# EAGLE design GBM-14to6 (EAGLE 5.12)
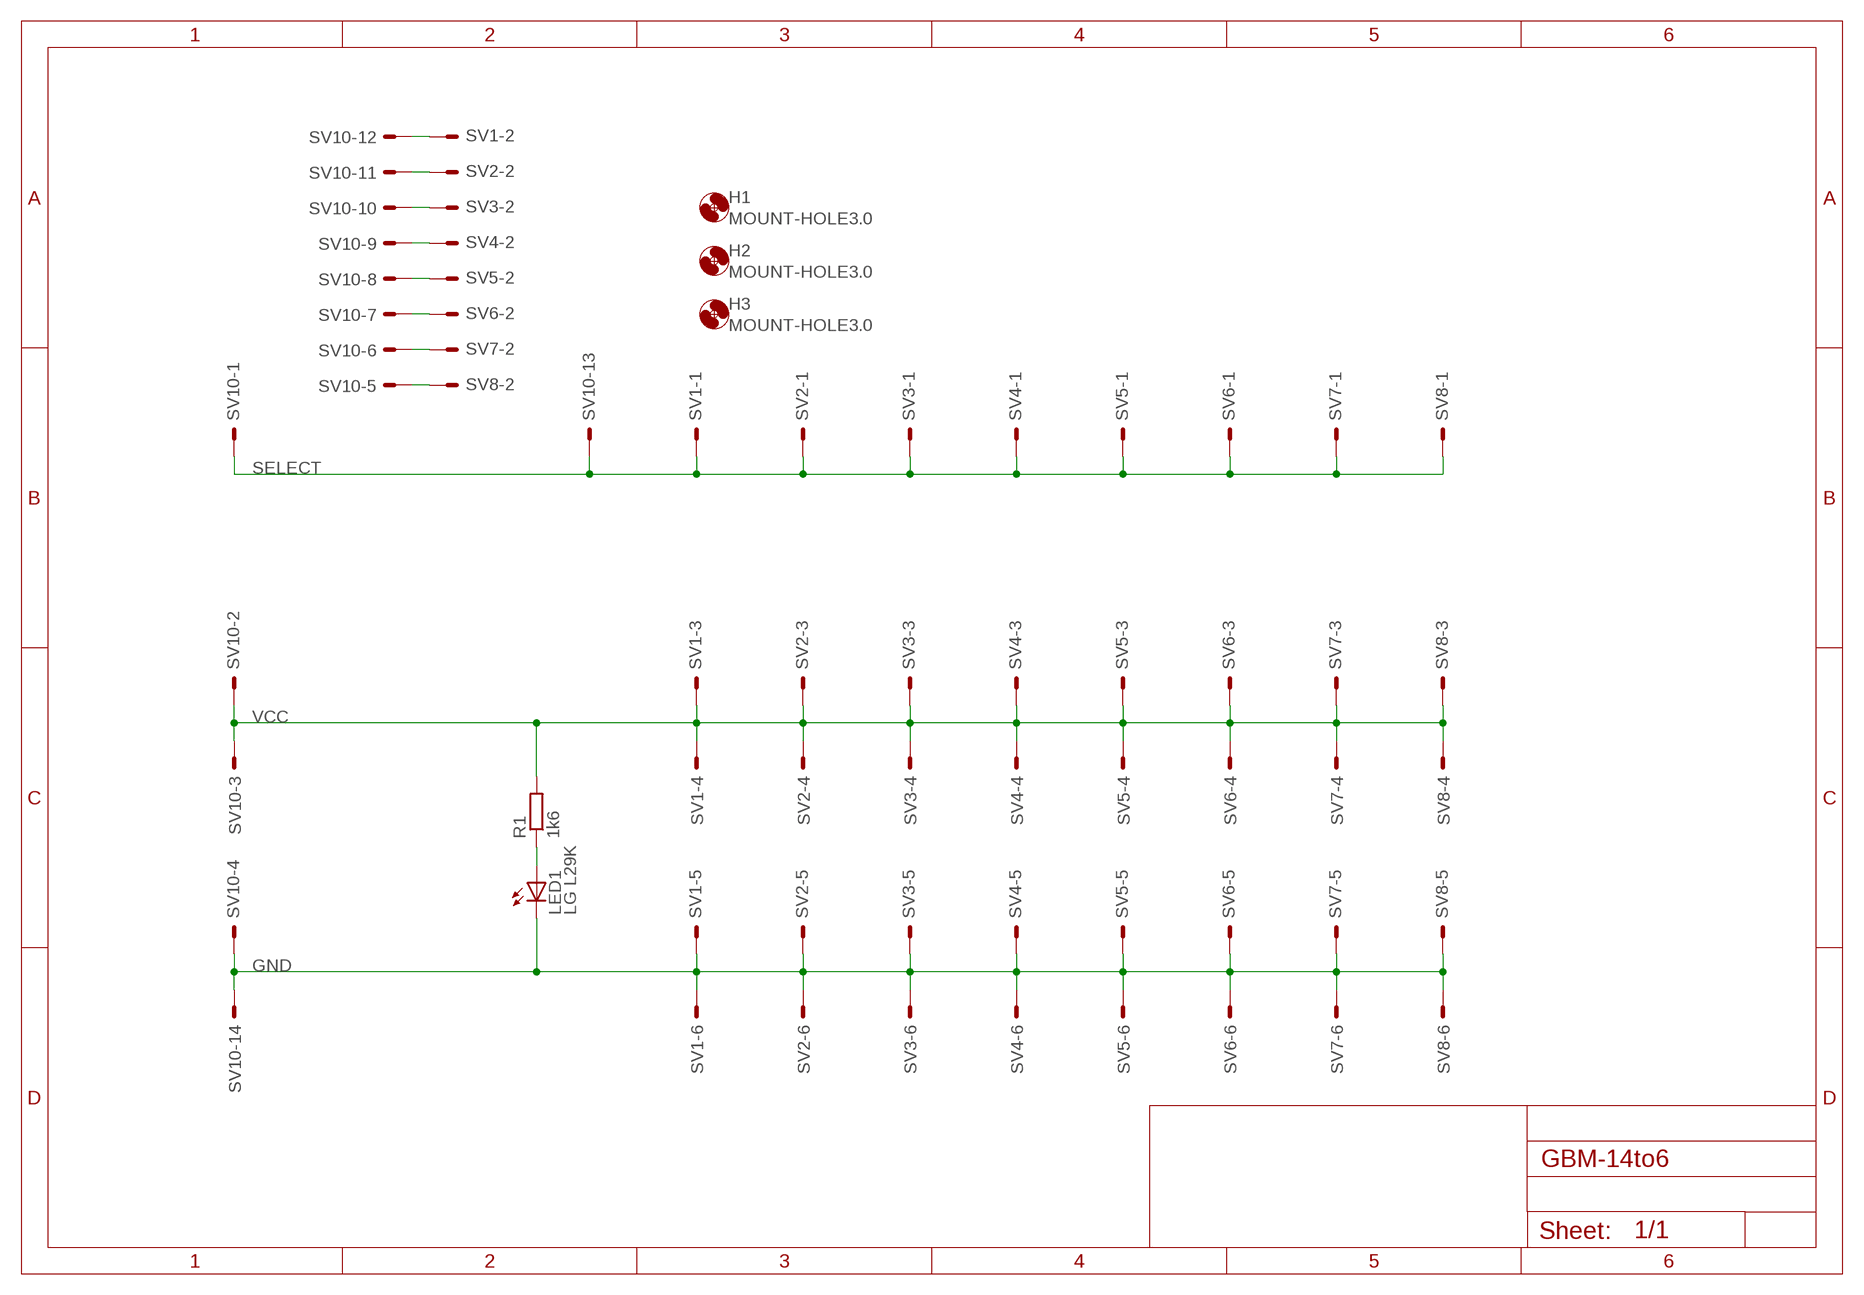
[diagram p0: schematic, sheet 1]

## Parts
H1  MOUNT-HOLE3.0  [3,0]
H2  MOUNT-HOLE3.0  [3,0]
H3  MOUNT-HOLE3.0  [3,0]
LED1  LG L29K  LEDCHIP-LED0603  [CHIP-LED0603]
R1  1k6  R-EU_R0603  [R0603]
SV1  ML6E  [ML6]
SV2  ML6E  [ML6]
SV3  ML6E  [ML6]
SV4  ML6E  [ML6]
SV5  ML6E  [ML6]
SV6  ML6E  [ML6]
SV7  ML6E  [ML6]
SV8  ML6E  [ML6]
SV10  ML14E  [ML14]

## Nets
GND: LED1.C SV1.5 SV1.6 SV2.5 SV2.6 SV3.5 SV3.6 SV4.5 SV4.6 SV5.5 SV5.6 SV6.5 SV6.6 SV7.5 SV7.6 SV8.5 SV8.6 SV10.4 SV10.14
N$1: SV1.2 SV10.12
N$2: SV2.2 SV10.11
N$3: SV3.2 SV10.10
N$4: SV4.2 SV10.9
N$5: SV5.2 SV10.8
N$6: SV6.2 SV10.7
N$7: SV7.2 SV10.6
N$8: SV8.2 SV10.5
N$9: LED1.A R1.1
SELECT: SV1.1 SV2.1 SV3.1 SV4.1 SV5.1 SV6.1 SV7.1 SV8.1 SV10.1 SV10.13
VCC: R1.2 SV1.3 SV1.4 SV2.3 SV2.4 SV3.3 SV3.4 SV4.3 SV4.4 SV5.3 SV5.4 SV6.3 SV6.4 SV7.3 SV7.4 SV8.3 SV8.4 SV10.2 SV10.3

## Library data of the parts
H1-H3 = holes:MOUNT-HOLE: MOUNTING HOLE with drill center marker
LED1 = led:LED: LED OSRAM: - CHIPLED LG R971, LG N971, LY N971, LG Q971, LY Q971, LO R971, LY R971 LH N974, LH R974 LS Q976, LO Q976, LY Q976 LO Q996 - Hyper CHIPLED LW Q18S LB Q993, LB Q99A, LB R99A - SideLED LS A670, LO A670, LY A670, LG A670, LP A670 LB A673, LV A673, LT A673, LW A673 LH A674 LY A675 LS A676, LA A676, LO A676, LY A676, LW A676 LS A679, LY A679, LG A679 - Hyper Micro SIDELED® LS Y876, LA Y876, LO Y876, LY Y876 LT Y87S - SmartLED LW L88C, LW L88S LB L89C, LB L89S, LG L890 LS L89K, LO L89K, LY L89K LS L896, LA L896, LO L896, LY L896 - TOPLED LS T670, LO T670, LY T670, LG T670, LP T670 LSG T670, LSP T670, LSY T670, LOP T670, LYG T670 LG T671, LOG T671, LSG T671 LB T673, LV T673, LT T673, LW T673 LH T674 LS T676, LA T676, LO T676, LY T676, LB T676, LH T676, LSB T676, LW T676 LB T67C, LV T67C, LT T67C, LS T67K, LO T67K, LY T67K, LW E67C LS E67B, LA E67B, LO E67B, LY E67B, LB E67C, LV E67C, LT E67C LW T67C LS T679, LY T679, LG T679 LS T770, LO T770, LY T770, LG T770, LP T770 LB T773, LV T773, LT T773, LW T773 LH T774 LS E675, LA E675, LY E675, LS T675 LS T776, LA T776, LO T776, LY T776, LB T776 LHGB T686 LT T68C, LB T68C - Hyper Mini TOPLED® LB M676 - Mini TOPLED Santana® LG M470 LS M47K, LO M47K, LY M47K Source: http://www.osram.convergy.de LUXEON: - LUMILED® LXK2-PW12-R00, LXK2-PW12-S00, LXK2-PW14-U00, LXK2-PW14-V00 LXK2-PM12-R00, LXK2-PM12-S00, LXK2-PM14-U00 LXK2-PE12-Q00, LXK2-PE12-R00, LXK2-PE12-S00, LXK2-PE14-T00, LXK2-PE14-U00 LXK2-PB12-K00, LXK2-PB12-L00, LXK2-PB12-M00, LXK2-PB14-N00, LXK2-PB14-P00, LXK2-PB14-Q00 LXK2-PR12-L00, LXK2-PR12-M00, LXK2-PR14-Q00, LXK2-PR14-R00 LXK2-PD12-Q00, LXK2-PD12-R00, LXK2-PD12-S00 LXK2-PH12-R00, LXK2-PH12-S00 LXK2-PL12-P00, LXK2-PL12-Q00, LXK2-PL12-R00 Source: www.luxeon.com KINGBRIGHT: KA-3528ASYC Source: www.kingbright.com
R1 = rcl:R-EU_: RESISTOR, European symbol
SV1-SV8 = con-harting-ml:ML6?E: HARTING
SV10 = con-harting-ml:ML14?E: HARTING

## Board
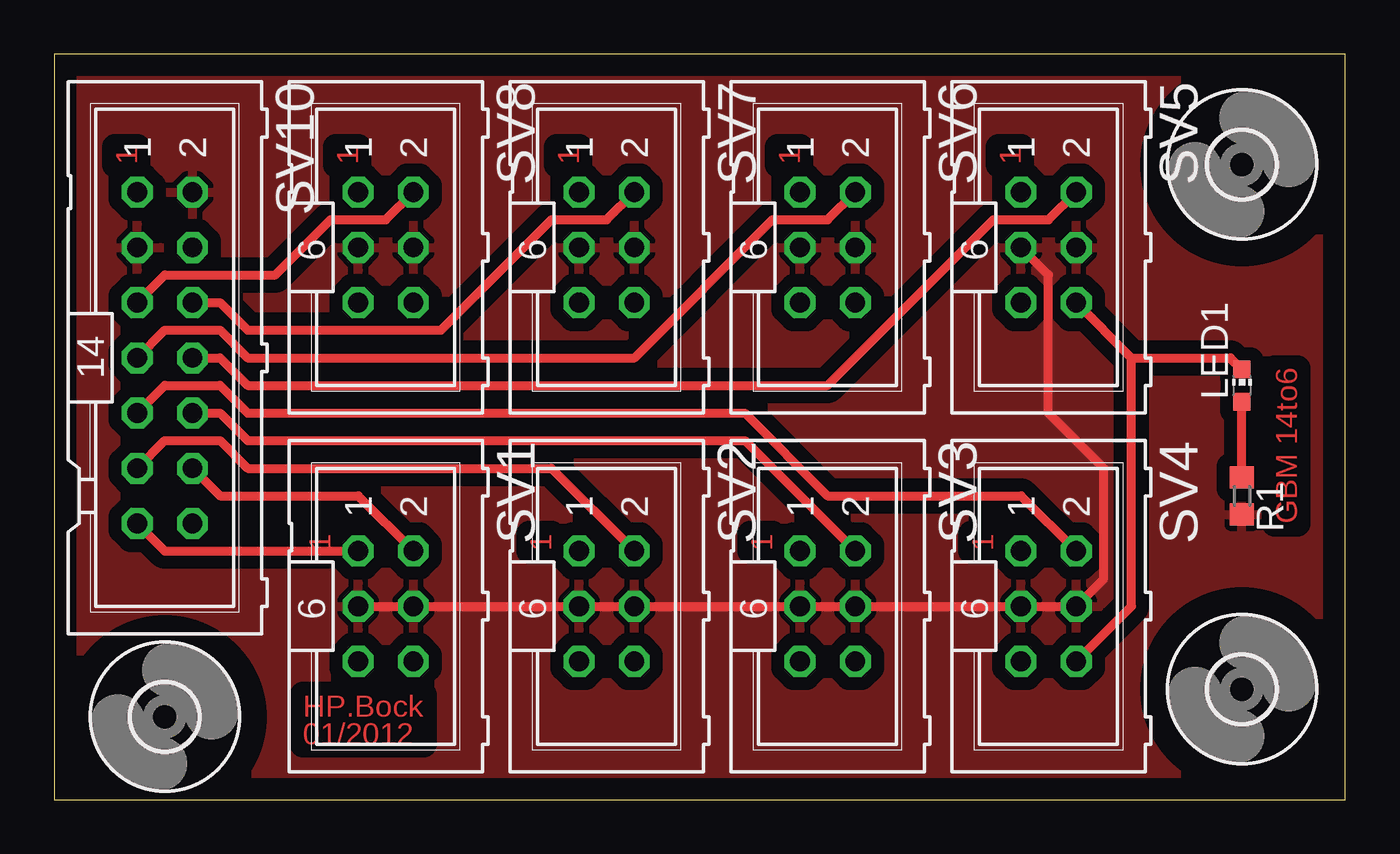
[diagram p1: board, top side]
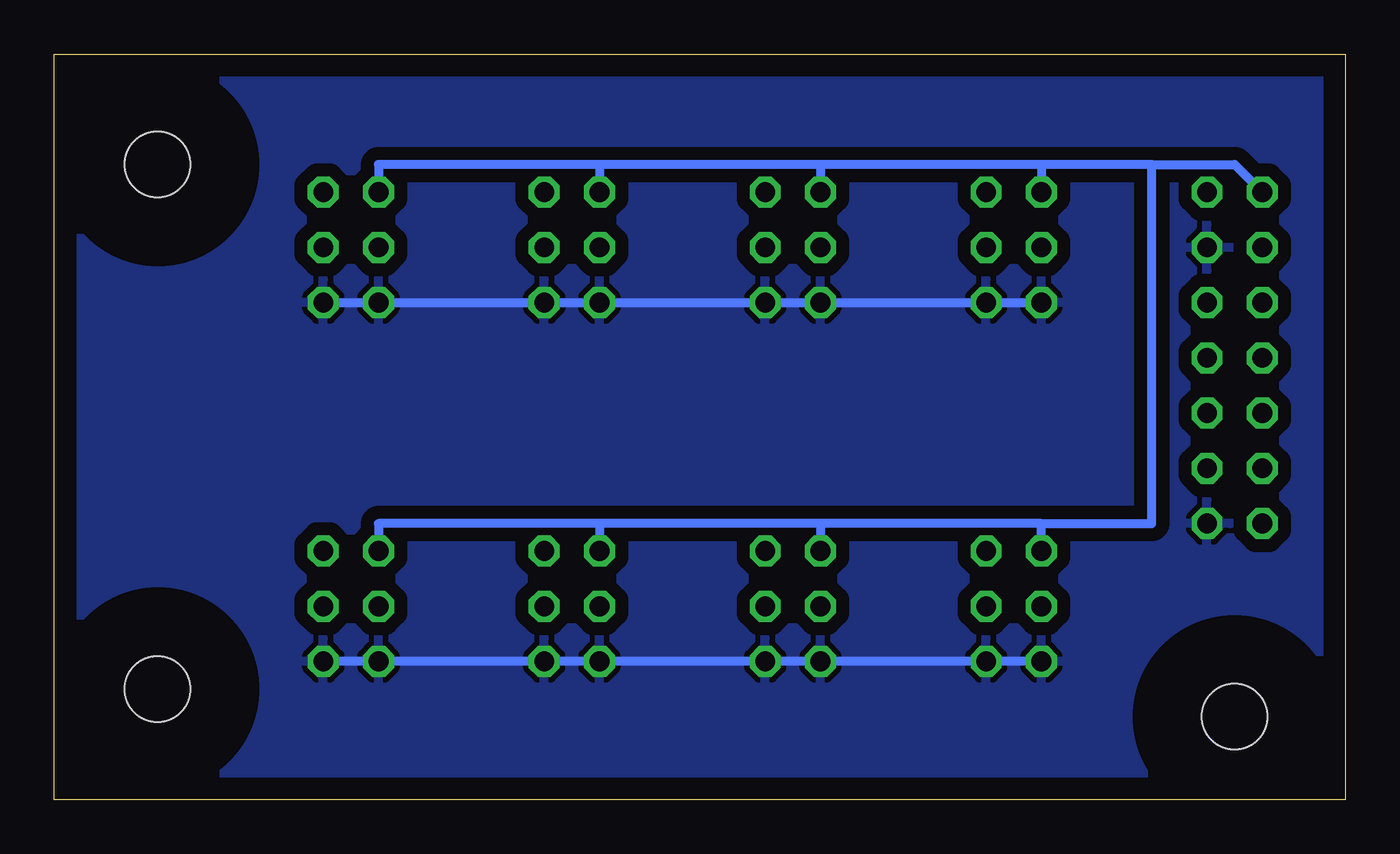
[diagram p2: board, bottom side, seen from below]

Size 59.36 x 34.28 mm. Coordinates in mm from the lower left corner, seen from the top.
Outline: 0,0 59.36,0 59.36,34.28 0,34.28 0,0
Copper layers (1*16): Top 0.035mm / dielectric 1.5mm / Bottom 0.035mm
Design rules "Bilex DRU": minimum track width 10mil, minimum drill 24mil, track to track 10mil, track to pad 10mil, pad to pad 10mil, via to via 10mil, smd to smd 10mil, copper to edge 40mil, drill to drill 8mil, minimum pad ring 10mil, minimum via ring 8mil, stop-mask expansion 4mil, vias tented up to drill 0mil, thermal gap 10mil

### Footprints (pad centres in the part's own frame; a part is rotated, then mirrored left to right if it is on the bottom)
3,0 = hole 3: 0,0
CHIP-LED0603 = smd 0.8 x 0.8: A 0,-0.75; C 0,0.75
R0603 = smd 1 x 1.1: 1 -0.85,0; 2 0.85,0
ML6 = drill 0.914 octagon: 1 -2.54,-1.27; 2 -2.54,1.27; 3 0,-1.27; 4 0,1.27; 5 2.54,-1.27; 6 2.54,1.27
ML14 = drill 0.914 octagon: 1 -7.62,-1.27; 2 -7.62,1.27; 3 -5.08,-1.27; 4 -5.08,1.27; 5 -2.54,-1.27; 6 -2.54,1.27; 7 0,-1.27; 8 0,1.27; 9 2.54,-1.27; 10 2.54,1.27; 11 5.08,-1.27; 12 5.08,1.27; 13 7.62,-1.27; 14 7.62,1.27

### Placement (x,y rotation side)
H1  54.61,5.08 0 top
H2  54.61,29.21 0 top
H3  5.08,3.81 0 top
LED1  54.61,19.05 0 top
R1  54.61,13.97 270 top
SV1  15.24,8.89 270 top
SV2  25.4,8.89 270 top
SV3  35.56,8.89 270 top
SV4  45.72,8.89 270 top
SV5  45.72,25.4 270 top
SV6  35.56,25.4 270 top
SV7  25.4,25.4 270 top
SV8  15.24,25.4 270 top
SV10  5.08,20.32 270 top

### Tracks (layer width: path | path; a pad name or v marks a point on that pad's centre or on a via)
GND
  Top 0.406: SV4.6 49.53,8.89 49.53,20.32 | 49.53,20.32 SV5.6 | LED1.C 54.09,20.32 49.53,20.32
  Bottom 0.406: SV1.5 SV1.6 SV2.5 SV2.6 SV3.5 SV3.6 SV4.5 SV4.6 | SV5.6 SV5.5 SV6.6 SV6.5 SV7.6 SV7.5 SV8.6 SV8.5
  pour Bottom (isolate 0.61): 0,0 0,34.29 58.42,34.29 58.42,0
N$1
  Top 0.406: SV1.2 13.97,13.97 7.62,13.97 SV10.12
N$2
  Top 0.406: SV2.2 22.86,15.24 8.89,15.24 7.62,16.51 5.08,16.51 SV10.11
N$3
  Top 0.406: SV3.2 31.75,16.51 8.89,16.51 7.62,17.78 SV10.10
N$4
  Top 0.406: SV4.2 44.45,13.97 35.56,13.97 31.75,17.78 8.89,17.78 7.62,19.05 5.08,19.05 SV10.9
N$5
  Top 0.406: SV5.2 45.72,26.67 43.18,26.67 35.56,19.05 8.89,19.05 7.62,20.32 SV10.8
N$6
  Top 0.406: SV6.2 35.56,26.67 33.02,26.67 26.67,20.32 8.89,20.32 7.62,21.59 5.08,21.59 SV10.7
N$7
  Top 0.406: SV7.2 25.4,26.67 22.86,26.67 17.78,21.59 8.89,21.59 7.62,22.86 SV10.6
N$8
  Top 0.406: SV8.2 15.24,26.67 12.7,26.67 10.16,24.13 5.08,24.13 SV10.5
N$9
  Top 0.406: R1.1 LED1.A
SELECT
  Top 0.406: SV10.13 5.08,11.43 SV1.1
  Bottom 0.406: SV4.1 44.45,12.7 34.29,12.7 | 13.97,12.7 24.13,12.7 | SV1.1 13.97,12.7 | 24.13,12.7 SV2.1 | 34.29,12.7 SV3.1 | SV5.1 44.45,29.21 34.29,29.21 | 13.97,29.21 24.13,29.21 | 24.13,29.21 34.29,29.21 | 34.29,29.21 SV6.1 | 24.13,29.21 SV7.1 | 13.97,29.21 SV8.1 | 8.89,29.21 5.08,29.21 SV10.1 | 8.89,29.21 13.97,29.21 | 24.13,12.7 34.29,12.7 | 13.97,12.7 8.89,12.7 8.89,29.21
VCC
  Top 0.406: SV5.3 45.72,24.13 45.72,17.78 48.26,15.24 48.26,10.16 SV4.4 SV4.3 SV3.4 SV3.3 SV2.4 SV2.3 SV1.4 SV1.3
  pour Top (isolate 0.61): 0,0 0,34.29 58.42,34.29 58.42,0

### Text on the board
Top: 1 | 1 | 1 | 1 | 1 | GBM 14to6 | 1 | 1 | 1 | 1 | HP.Bock | 01/2012